# EAGLE design Parkkischema3 (EAGLE 9.5.2)
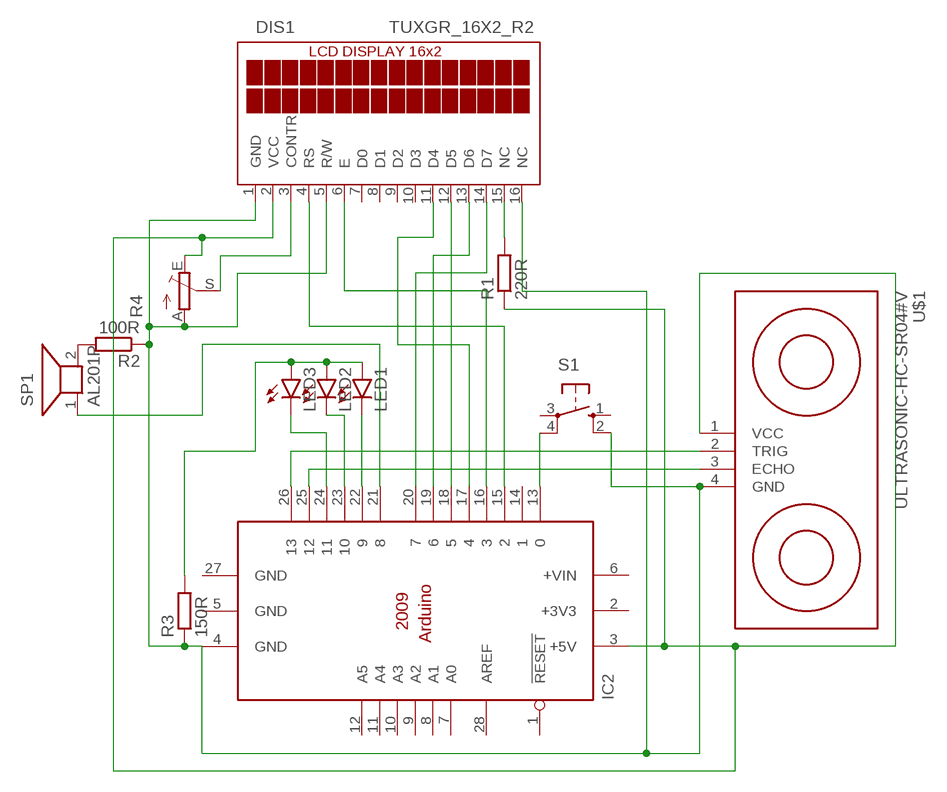
[diagram p0: schematic, sheet 1]

## Parts
DIS1  TUXGR_16X2_R2  [TUXGR_16X2_R2]
IC2  ARDUINO2009_10  [ARDUINO2009]
LED1  LED5MM  [LED5MM]
LED2  LED5MM  [LED5MM]
LED3  LED5MM  [LED5MM]
R1  220R  R-EU_0204/7  [0204/7]
R2  100R  R-EU_0204/7  [0204/7]
R3  150R  R-EU_0204/7  [0204/7]
R4  TRIM_EU-CA6V  [CA6V]
S1  10-XX  [B3F-10XX]
SP1  AL201P  [AL201P]
U$1  ULTRASONIC-HC-SR04#V  [ULTRASONIC-HC-SR04#V]

## Nets
N$1: R2.2 SP1.2
N$2: DIS1.4(RS) IC2.15
N$3: IC2.21 SP1.1
N$4: LED1.A LED2.A LED3.A R3.2
N$5: IC2.22 LED1.K(C)
N$6: DIS1.6(E) IC2.16
N$7: DIS1.3(CONTR) R4.S
N$8: DIS1.15(NC) R1.2
N$9: IC2.23 LED2.K(C)
N$10: IC2.24 LED3.K(C)
N$11: IC2.26 U$1.2(TRIG)
N$12: IC2.13 S1.4(P1)
N$13: DIS1.2(VCC) IC2.3(+5V) R1.1 R4.E U$1.1(VCC)
N$14: DIS1.1(GND) DIS1.5(R/W) DIS1.16(NC) IC2.4(GND) R2.1 R3.1 R4.A S1.2(S1) U$1.4(GND)
N$15: DIS1.11(D4) IC2.17
N$16: DIS1.12(D5) IC2.18
N$17: DIS1.13(D6) IC2.19
N$18: DIS1.14(D7) IC2.20
N$19: IC2.25 U$1.3(ECHO)
Unconnected: DIS1.7(D0) DIS1.8(D1) DIS1.9(D2) DIS1.10(D3) IC2.1(!RESET) IC2.6(+VIN) IC2.7(A0) IC2.8(A1) IC2.9(A2) IC2.10(A3) IC2.11(A4) IC2.12(A5) IC2.14 IC2.28(AREF) S1.1(S) S1.3(P)

## Power pins joined to a net without a drawn wire
+3V3: IC2.2(+3V3)
GND: IC2.5(GND) IC2.27(GND)

## Library data of the parts
DIS1 = display-lcd:TUXGR_16X2_R2: Tuxgraphics LCD display 16x2 characters reflective, without background light Source: tuxgr_12x2_r2.pdf; OC_FARNELL: unknown; OC_NEWARK: unknown
IC2 = arduino:ARDUINO2009_1: The Arduino Duemilanove ("2009") is a microcontroller board based on the ATmega168 or ATmega328. - 14 digital input/output pins (of which 6 can be used as PWM outputs) - 6 analog inputs, a 16 MHz crystal oscillator - USB connection - power jack - ISP header - reset button It contains everything needed to support the microcontroller; simply connect it to a computer with a USB cable or power it with a AC-to-DC adapter or battery to get started http://arduino.cc/en/Main/ArduinoBoardDuemilanove
LED1-LED3 = led:LED: LED OSRAM: - CHIPLED LG R971, LG N971, LY N971, LG Q971, LY Q971, LO R971, LY R971 LH N974, LH R974 LS Q976, LO Q976, LY Q976 LO Q996 - Hyper CHIPLED LW Q18S LB Q993, LB Q99A, LB R99A - SideLED LS A670, LO A670, LY A670, LG A670, LP A670 LB A673, LV A673, LT A673, LW A673 LH A674 LY A675 LS A676, LA A676, LO A676, LY A676, LW A676 LS A679, LY A679, LG A679 - Hyper Micro SIDELED® LS Y876, LA Y876, LO Y876, LY Y876 LT Y87S - SmartLED LW L88C, LW L88S LB L89C, LB L89S, LG L890 LS L89K, LO L89K, LY L89K LS L896, LA L896, LO L896, LY L896 - TOPLED LS T670, LO T670, LY T670, LG T670, LP T670 LSG T670, LSP T670, LSY T670, LOP T670, LYG T670 LG T671, LOG T671, LSG T671 LB T673, LV T673, LT T673, LW T673 LH T674 LS T676, LA T676, LO T676, LY T676, LB T676, LH T676, LSB T676, LW T676 LB T67C, LV T67C, LT T67C, LS T67K, LO T67K, LY T67K, LW E67C LS E67B, LA E67B, LO E67B, LY E67B, LB E67C, LV E67C, LT E67C LW T67C LS T679, LY T679, LG T679 LS T770, LO T770, LY T770, LG T770, LP T770 LB T773, LV T773, LT T773, LW T773 LH T774 LS E675, LA E675, LY E675, LS T675 LS T776, LA T776, LO T776, LY T776, LB T776 LHGB T686 LT T68C, LB T68C - Hyper Mini TOPLED® LB M676 - Mini TOPLED Santana® LG M470 LS M47K, LO M47K, LY M47K Source: http://www.osram.convergy.de LUXEON: - LUMILED® LXK2-PW12-R00, LXK2-PW12-S00, LXK2-PW14-U00, LXK2-PW14-V00 LXK2-PM12-R00, LXK2-PM12-S00, LXK2-PM14-U00 LXK2-PE12-Q00, LXK2-PE12-R00, LXK2-PE12-S00, LXK2-PE14-T00, LXK2-PE14-U00 LXK2-PB12-K00, LXK2-PB12-L00, LXK2-PB12-M00, LXK2-PB14-N00, LXK2-PB14-P00, LXK2-PB14-Q00 LXK2-PR12-L00, LXK2-PR12-M00, LXK2-PR14-Q00, LXK2-PR14-R00 LXK2-PD12-Q00, LXK2-PD12-R00, LXK2-PD12-S00 LXK2-PH12-R00, LXK2-PH12-S00 LXK2-PL12-P00, LXK2-PL12-Q00, LXK2-PL12-R00 Source: www.luxeon.com KINGBRIGHT: KA-3528ASYC Source: www.kingbright.com
R1-R3 = rcl:R-EU_: RESISTOR, European symbol; SPICEPREFIX: R
R4 = pot:TRIM_EU-: POTENTIOMETER
S1 = switch-omron:10-XX: OMRON SWITCH; MPN: B3F-1000; OC_FARNELL: 176432; OC_NEWARK: 36M3542
SP1 = buzzer:AL201P: SPEAKER Source: Buerklin; OC_FARNELL: unknown; OC_NEWARK: unknown
U$1 = diy-modules:ULTRASONIC-HC-SR04: Ultrasonic Ranging Module HC-SR04 More details available here: http://randomnerdtutorials.com/complete-guide-for-ultrasonic-sensor-hc-sr04/ Click here to find device on ebay.com <http://www.ebay.com/sch/hc+sr04+ultrasonic>

## Net classes
0 default: width 1.016 mm, clearance 0.381 mm

## Board
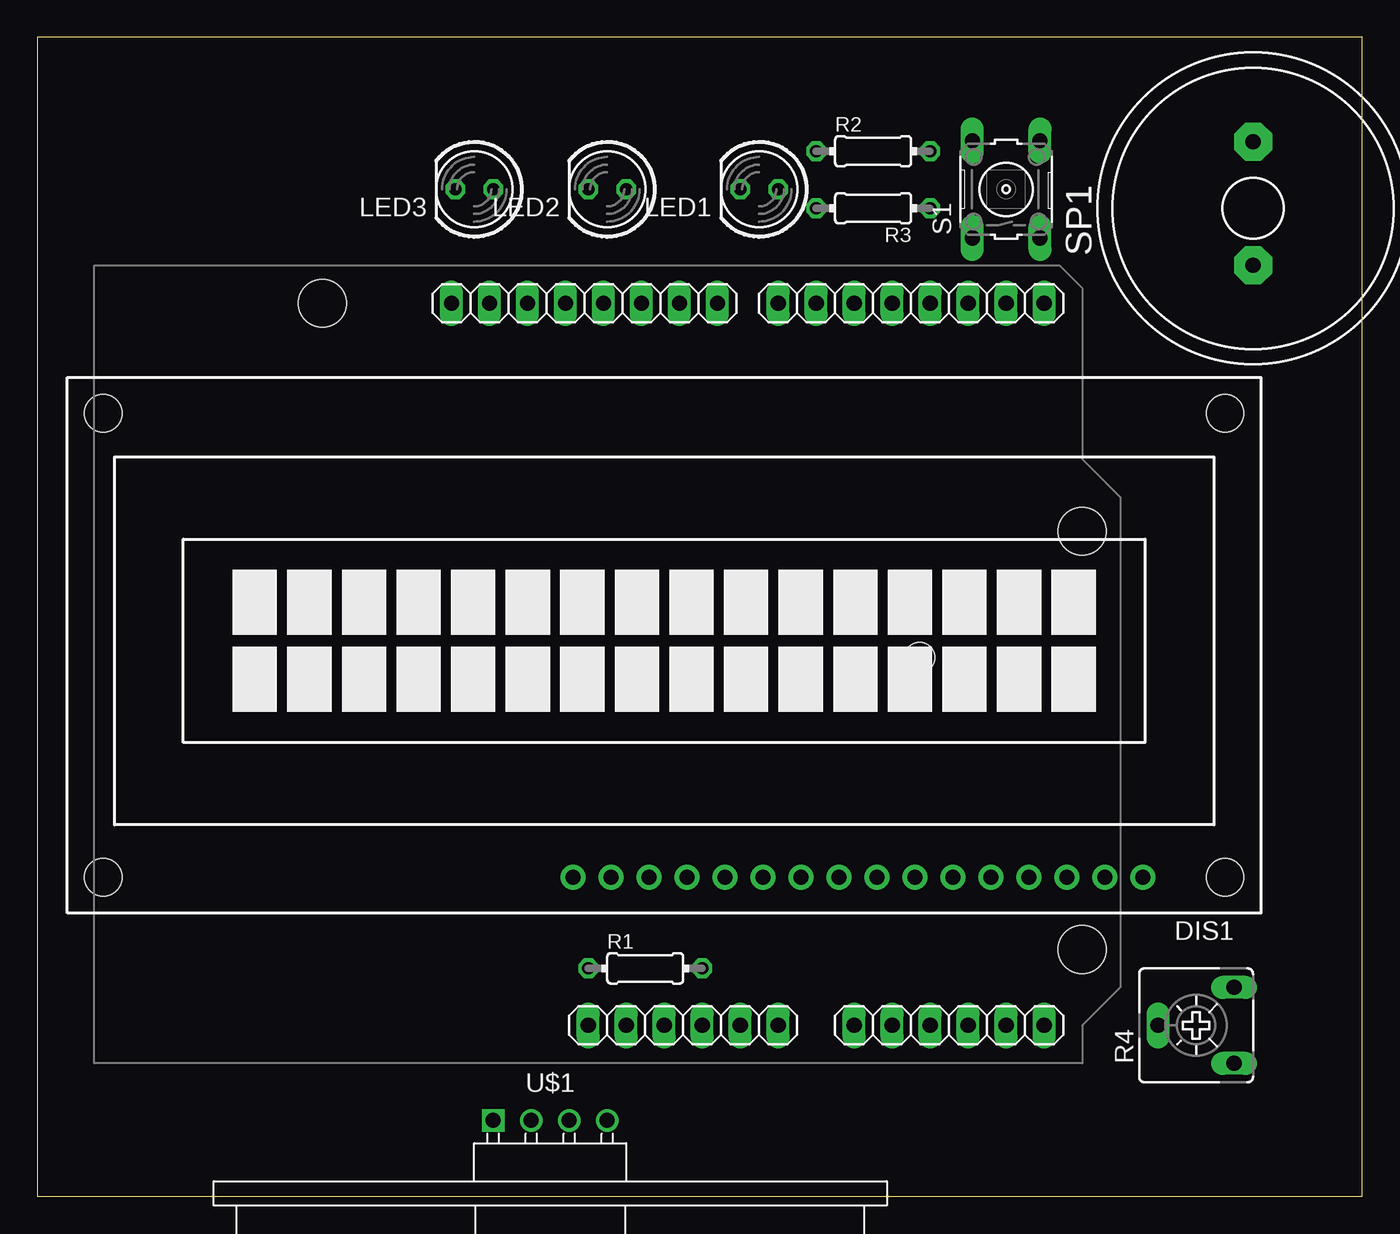
[diagram p1: board, top side]
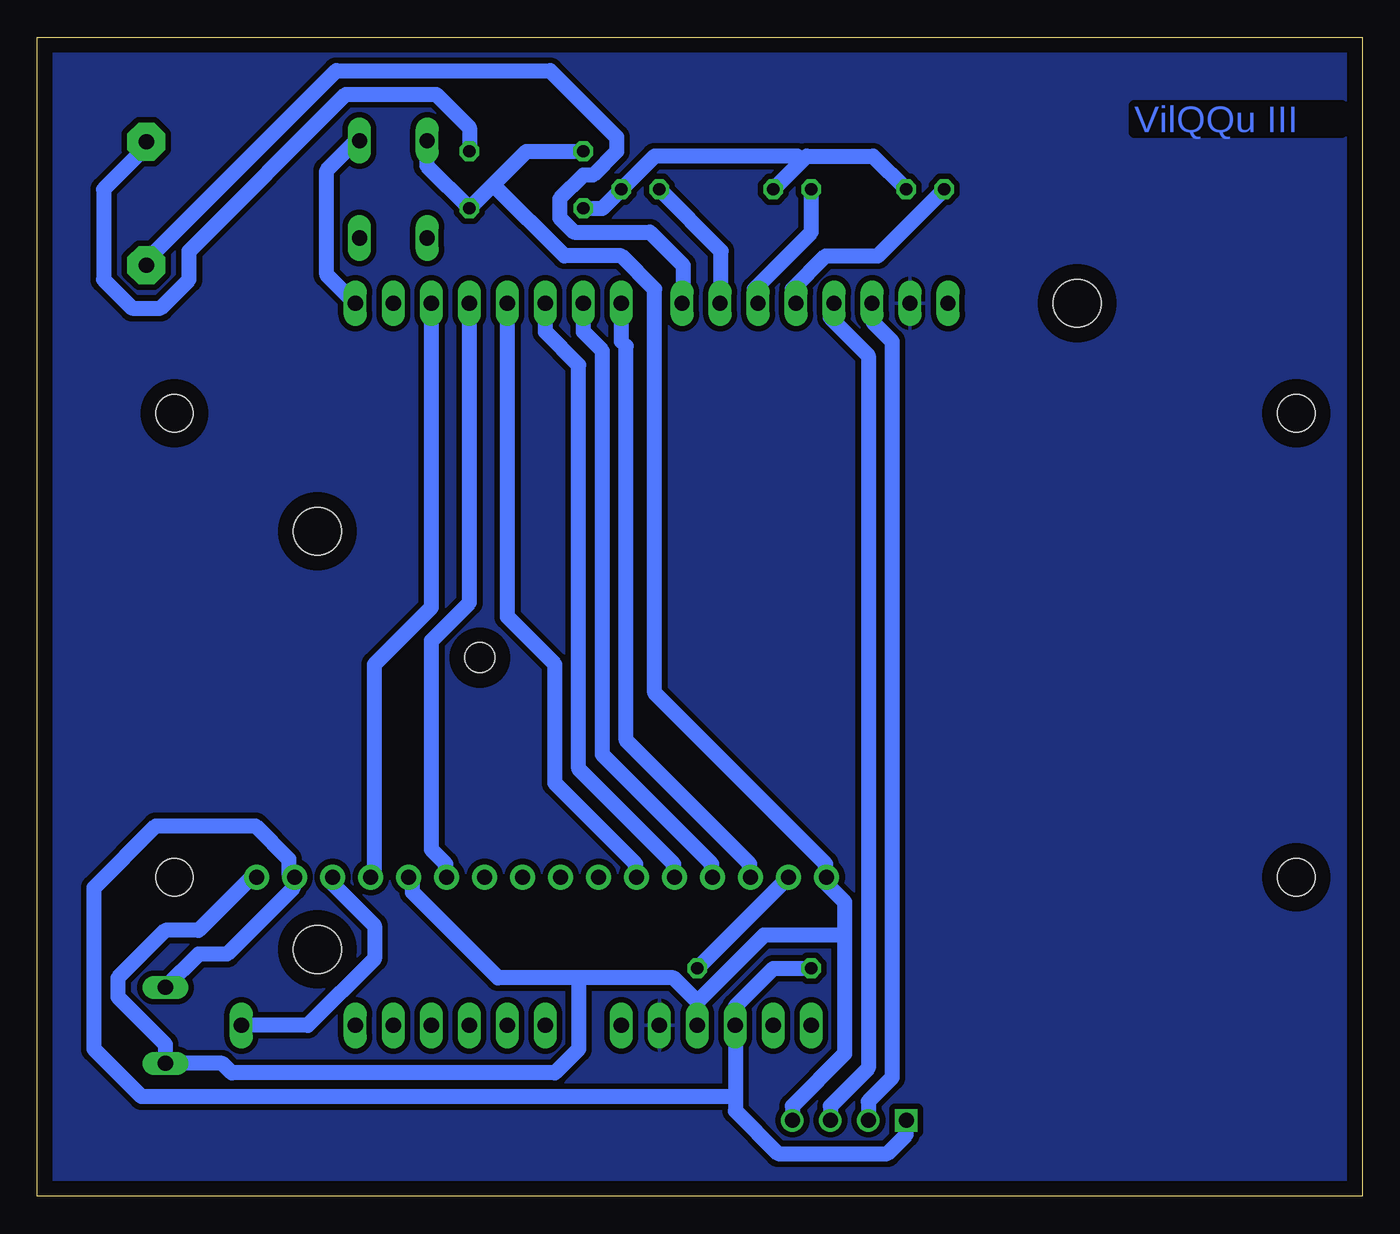
[diagram p2: board, bottom side, seen from below]

Size 88.57 x 77.46 mm. Coordinates in mm from the lower left corner, seen from the top.
Outline: 0,0 88.57,0 88.57,77.46 0,77.46 0,0
Copper layers (1*16): Top 0.035mm / dielectric 1.5mm / Bottom 0.035mm
Design rules "default": minimum track width 6mil, minimum drill 0.35mm, track to track 6mil, track to pad 6mil, pad to pad 6mil, via to via 6mil, smd to smd 6mil, copper to edge 40mil, drill to drill 6mil, minimum pad ring 10mil, minimum via ring 8mil, stop-mask expansion 4mil, vias tented up to drill 0mil, thermal gap 10mil

### Footprints (pad centres in the part's own frame; a part is rotated, then mirrored left to right if it is on the bottom)
TUXGR_16X2_R2 = drill 1 pad 1.676: 1 -32,15.5; 2 -29.46,15.5; 3 -26.92,15.5; 4 -24.38,15.5; 5 -21.84,15.5; 6 -19.3,15.5; 7 -16.76,15.5; 8 -14.22,15.5; 9 -11.68,15.5; 10 -9.14,15.5; 11 -6.6,15.5; 12 -4.06,15.5; 13 -1.52,15.5; 14 1.02,15.5; 15 3.56,15.5; 16 6.1,15.5 | hole 2.5: -37.5,-15.5; 37.5,-15.5; -37.5,15.5; 37.5,15.5
ARDUINO2009 = drill 1.016 long: 1 33.02,2.54; 2 35.56,2.54; 3 38.1,2.54; 4 40.64,2.54; 5 43.18,2.54; 6 45.72,2.54; 7 50.8,2.54; 8 53.34,2.54; 9 55.88,2.54; 10 58.42,2.54; 11 60.96,2.54; 12 63.5,2.54; 13 63.5,50.8; 14 60.96,50.8; 15 58.42,50.8; 16 55.88,50.8; 17 53.34,50.8; 18 50.8,50.8; 19 48.26,50.8; 20 45.72,50.8; 21 41.656,50.8; 22 39.116,50.8; 23 36.576,50.8; 24 34.036,50.8; 25 31.496,50.8; 26 28.956,50.8; 27 26.416,50.8; 28 23.876,50.8 | hole 3.2: 15.24,50.8; 66.04,35.56; 66.04,7.62 | hole 2: 55.17,27.114
LED5MM = drill 0.813 octagon: A -1.27,0; K 1.27,0
0204/7 = drill 0.813 octagon: 1 -3.81,0; 2 3.81,0
CA6V = drill 1.016 long: A -2.54,-2.54; E 2.54,-2.54; S 0,2.54
B3F-10XX = drill 1.016 long: 1 -3.251,2.261; 2 3.251,2.261; 3 -3.251,-2.261; 4 3.251,-2.261
AL201P = drill 1.016 pad 2.54 octagon: 1 -3.81,0; 2 4.445,0
ULTRASONIC-HC-SR04#V = drill 1 square: 1 -3.81,0 | drill 1: 2 -1.27,0; 3 1.27,0; 4 3.81,0

### Placement (x,y rotation side)
DIS1  41.91,36.83 180 top
IC2  3.81,8.89 0 top
LED1  48.26,67.31 180 top
LED2  38.1,67.31 180 top
LED3  29.21,67.31 180 top
R1  40.64,15.24 0 top
R2  55.88,69.85 0 top
R3  55.88,66.04 180 top
R4  77.47,11.43 90 top
S1  64.77,67.31 90 top
SP1  81.28,66.04 90 top
U$1  34.29,5.08 0 top

### Tracks (layer width: path | path; a pad name or v marks a point on that pad's centre or on a via)
GND
  pour Bottom: 0,77.47 0,0 88.9,0 88.9,77.47
N$1
  Bottom 1.016: R2.2 59.69,71.44 61.91,73.66 67.94,73.66 78.42,63.18 78.42,61.28 80.33,59.37 82.23,59.37 84.14,61.28 84.14,67.31 81.28,70.17 SP1.2
N$2
  Bottom 1.016: IC2.15 62.23,39.37 66.04,35.56 66.04,21.59 DIS1.4
N$3
  Bottom 1.016: SP1.1 81.28,62.55 68.58,75.25 54.29,75.25 49.85,70.8 49.85,69.85 51.44,68.26 52.07,68.26 53.66,66.68 53.66,65.41 52.7,64.45 47.62,64.45 45.4,62.23 45.4,59.69 IC2.21
N$4
  Bottom 1.016: R3.2 50.8,66.04 LED1.A 47.31,69.53 37.78,69.53 37.47,69.22 | LED3.A 32.7,69.53 37.15,69.53 37.47,69.22 | LED2.A 37.47,69.22
N$5
  Bottom 1.016: LED1.K 42.86,63.18 42.86,59.69 IC2.22
N$6
  Bottom 1.016: IC2.16 59.69,39.69 62.23,37.15 62.23,23.18 61.28,22.22 61.28,21.59 DIS1.6
N$7
  Bottom 1.016: R4.S 70.48,11.43 66.04,15.88 66.04,18.1 68.9,20.95 68.9,21.27 DIS1.3
N$8
  Bottom 1.016: R1.2 38.42,21.27 DIS1.15
N$9
  Bottom 1.016: LED2.K 36.83,64.45 40.64,60.64 40.64,59.69 IC2.23
N$10
  Bottom 1.016: LED3.K 32.38,62.87 35.88,62.87 38.1,60.64 38.1,59.69 IC2.24
N$11
  Bottom 1.016: U$1.2 33.02,6.35 31.43,7.94 31.43,57.15 32.7,58.42 32.7,59.69 IC2.26
N$12
  Bottom 1.016: IC2.13 69.22,61.59 69.22,68.58 67.31,70.48 S1.4
N$13
  Bottom 1.016: R4.E 77.79,16.19 75.88,16.19 71.44,20.64 71.44,21.27 DIS1.2 71.75,21.59 71.75,22.54 73.98,24.77 80.64,24.77 84.77,20.64 84.77,9.84 81.6,6.67 41.91,6.67 | R1.1 39.37,15.24 41.91,12.7 IC2.3 41.91,6.67 | U$1.1 30.48,4.13 31.75,2.86 39.05,2.86 41.91,5.71 41.91,6.67
N$14
  Bottom 1.016: DIS1.1 73.98,21.59 77.79,17.78 80.01,17.78 83.19,14.61 83.19,13.34 80.01,10.16 R4.A 76.2,8.89 75.56,8.25 53.98,8.25 52.39,9.84 52.39,14.61 | S1.2 62.55,70.48 62.55,68.9 R3.1 58.1,67.63 | R2.1 55.88,69.85 58.1,67.63 | U$1.4 38.1,6.03 34.61,9.53 34.61,17.46 | 34.61,17.46 34.61,19.68 35.88,20.95 35.88,21.27 DIS1.16 35.88,21.59 35.88,22.22 47.31,33.66 47.31,60.64 49.53,62.87 53.34,62.87 58.1,67.63 | 44.45,13.02 IC2.4 | 44.45,13.02 40.01,17.46 34.61,17.46 | 52.39,14.61 46.04,14.61 44.45,13.02 | 52.39,14.61 57.78,14.61 63.5,20.32 63.5,21.27 DIS1.5
N$15
  Bottom 1.016: IC2.17 57.15,38.73 53.98,35.56 53.98,27.62 48.58,22.22 48.58,21.59 DIS1.11
N$16
  Bottom 1.016: IC2.18 54.61,57.78 52.39,55.56 52.39,28.57 46.04,22.22 46.04,21.59 DIS1.12
N$17
  Bottom 1.016: IC2.19 52.07,57.78 50.8,56.52 50.8,29.53 43.5,22.22 43.5,21.59 DIS1.13
N$18
  Bottom 1.016: IC2.20 49.53,57.15 49.21,56.83 49.21,30.48 40.96,22.22 40.96,21.59 DIS1.14
N$19
  Bottom 1.016: U$1.3 35.56,6.03 33.02,8.57 33.02,56.2 35.56,58.74 35.56,59.69 IC2.25

### Text on the board
Bottom: VilQQu III